# EAGLE design USB23DO (EAGLE 9.6.2)
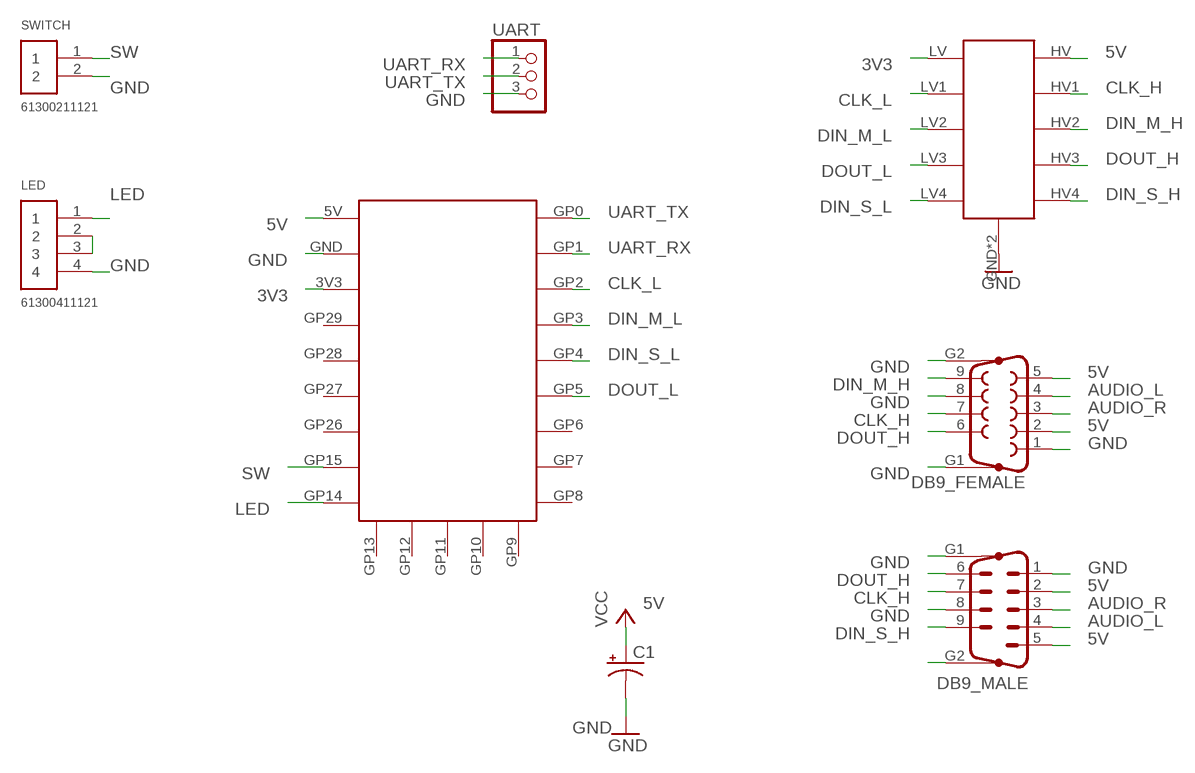
[diagram p0: schematic, sheet 1]

## Parts
C1  CPOL-USB45181A  [B45181A]
DB9_FEMALE  F09HP  [F09HP]
DB9_MALE  M09HP  [M09HP]
LED  61300411121  [61300411121]
LVL_SHIFTER  4WAYS_LEVEL_SHIFTER  [4WAYS_LEVEL_SHIFTER]
RP2040-ZERO  WAVESHARE_RP_2040_ZERO  [WAVESHARE_RP_2040_ZERO]
SWITCH  61300211121  [61300211121]
UART  PINHD-1X3CB  [1X03-CLEANBIG]

## Nets
3V3: LVL_SHIFTER.LV RP2040-ZERO.3V3
5V: C1.+ DB9_FEMALE.2 DB9_FEMALE.5 DB9_MALE.2 DB9_MALE.5 LVL_SHIFTER.HV RP2040-ZERO.5V ; supply symbol labelled VCC
AUDIO_L: DB9_FEMALE.4 DB9_MALE.4
AUDIO_R: DB9_FEMALE.3 DB9_MALE.3
CLK_H: DB9_FEMALE.7 DB9_MALE.7 LVL_SHIFTER.HV1
CLK_L: LVL_SHIFTER.LV1 RP2040-ZERO.GP2
DIN_M_H: DB9_FEMALE.9 LVL_SHIFTER.HV2
DIN_M_L: LVL_SHIFTER.LV2 RP2040-ZERO.GP3
DIN_S_H: DB9_MALE.9 LVL_SHIFTER.HV4
DIN_S_L: LVL_SHIFTER.LV4 RP2040-ZERO.GP4
DOUT_H: DB9_FEMALE.6 DB9_MALE.6 LVL_SHIFTER.HV3
DOUT_L: LVL_SHIFTER.LV3 RP2040-ZERO.GP5
GND: C1.- DB9_FEMALE.1 DB9_FEMALE.8 DB9_FEMALE.G1 DB9_FEMALE.G2 DB9_MALE.1 DB9_MALE.8 DB9_MALE.G1 LED.4 LVL_SHIFTER.GND LVL_SHIFTER.GND_1(GND) RP2040-ZERO.GND SWITCH.2 UART.3
LED: LED.1 RP2040-ZERO.GP14
N$1: LED.2 LED.3
N$2: DB9_MALE.G2
SW: RP2040-ZERO.GP15 SWITCH.1
UART_RX: RP2040-ZERO.GP1 UART.1
UART_TX: RP2040-ZERO.GP0 UART.2
Unconnected: RP2040-ZERO.GP6 RP2040-ZERO.GP7 RP2040-ZERO.GP8 RP2040-ZERO.GP9 RP2040-ZERO.GP10 RP2040-ZERO.GP11 RP2040-ZERO.GP12 RP2040-ZERO.GP13 RP2040-ZERO.GP26 RP2040-ZERO.GP27 RP2040-ZERO.GP28 RP2040-ZERO.GP29

## Library data of the parts
C1 = adafruit:CPOL-US: POLARIZED CAPACITOR, American symbol
DB9_FEMALE = con-subd:F09HP: SUB-D; OC_FARNELL: unknown; OC_NEWARK: unknown
DB9_MALE = con-subd:M09HP: SUB-D; OC_FARNELL: unknown; OC_NEWARK: unknown
LED = Headers:61300411121: CONN HEADER VERT 4POS 2.54MM Manufacturer's datasheet <https://katalog.we-online.de/em/datasheet/6130xx11121.pdf>; CREATED_BY: PCBLayout.com; DIGI_KEY_PART_NUMBER: 732-5317-ND; MANUFACTURER: Wurth Electronics Inc.; MPN: 61300411121
LVL_SHIFTER = FunModules:4WAYS_LEVEL_SHIFTER
RP2040-ZERO = FunModules:WAVESHARE_RP_2040_ZERO
SWITCH = Headers:61300211121: CONN HEADER VERT 2POS 2.54MM Manufacturer's datasheet <https://katalog.we-online.de/em/datasheet/6130xx11121.pdf>; CREATED_BY: PCBLayout.com; DIGI_KEY_PART_NUMBER: 732-5315-ND; MANUFACTURER: Wurth Electronics Inc.; MPN: 61300211121
UART = adafruit:PINHD-1X3: PIN HEADER

## Board
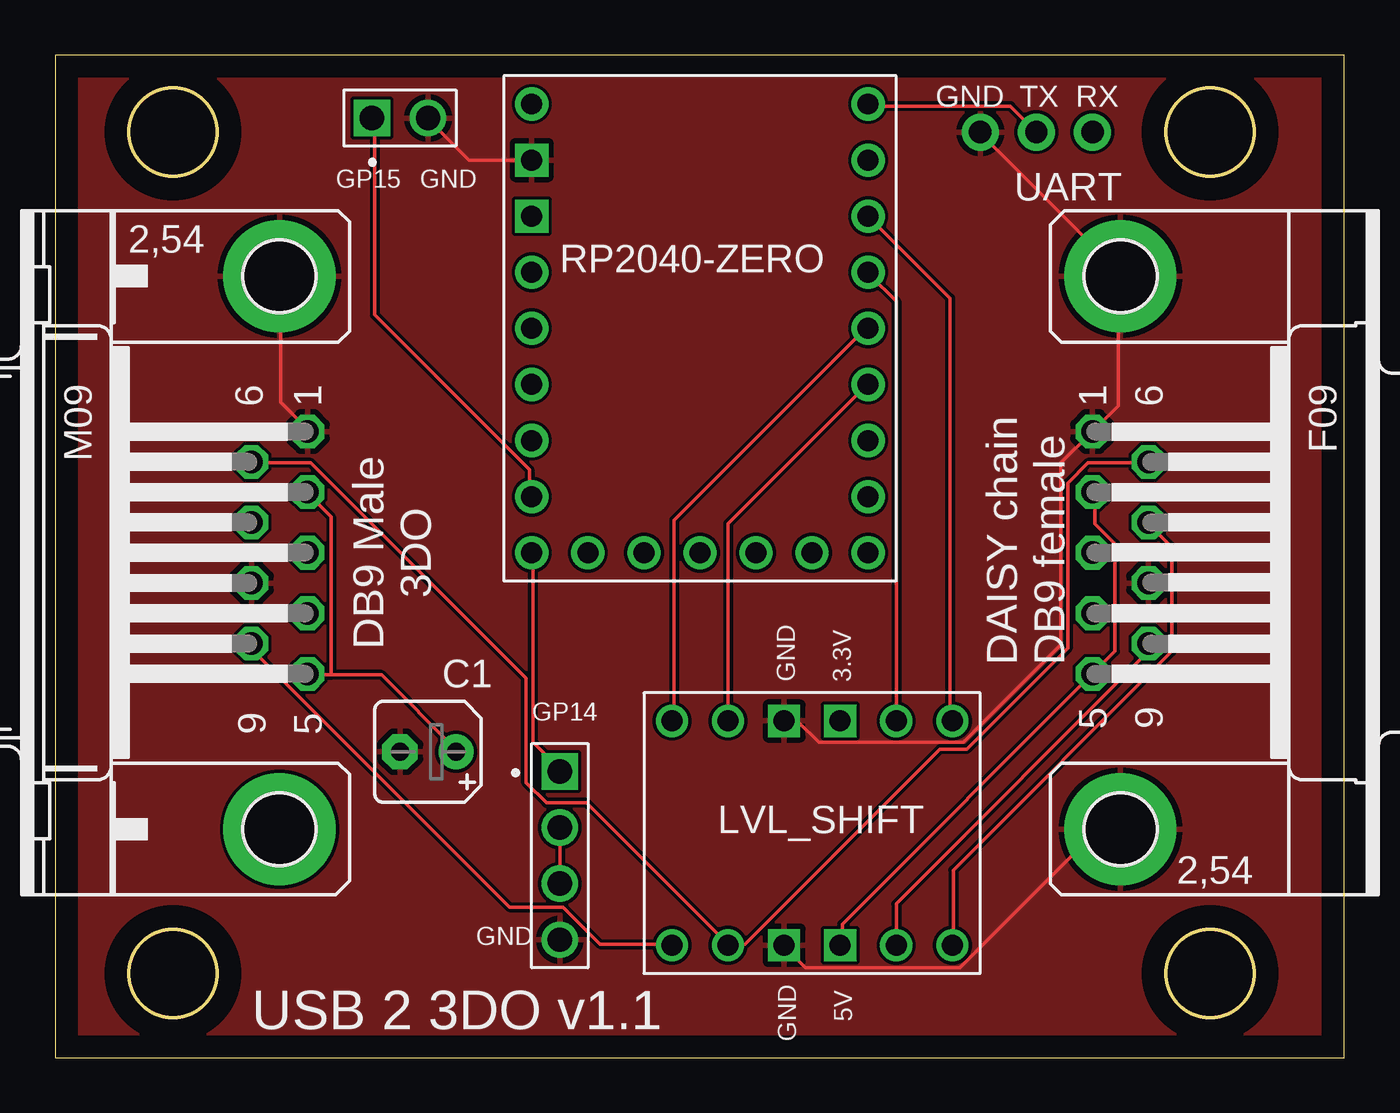
[diagram p1: board, top side]
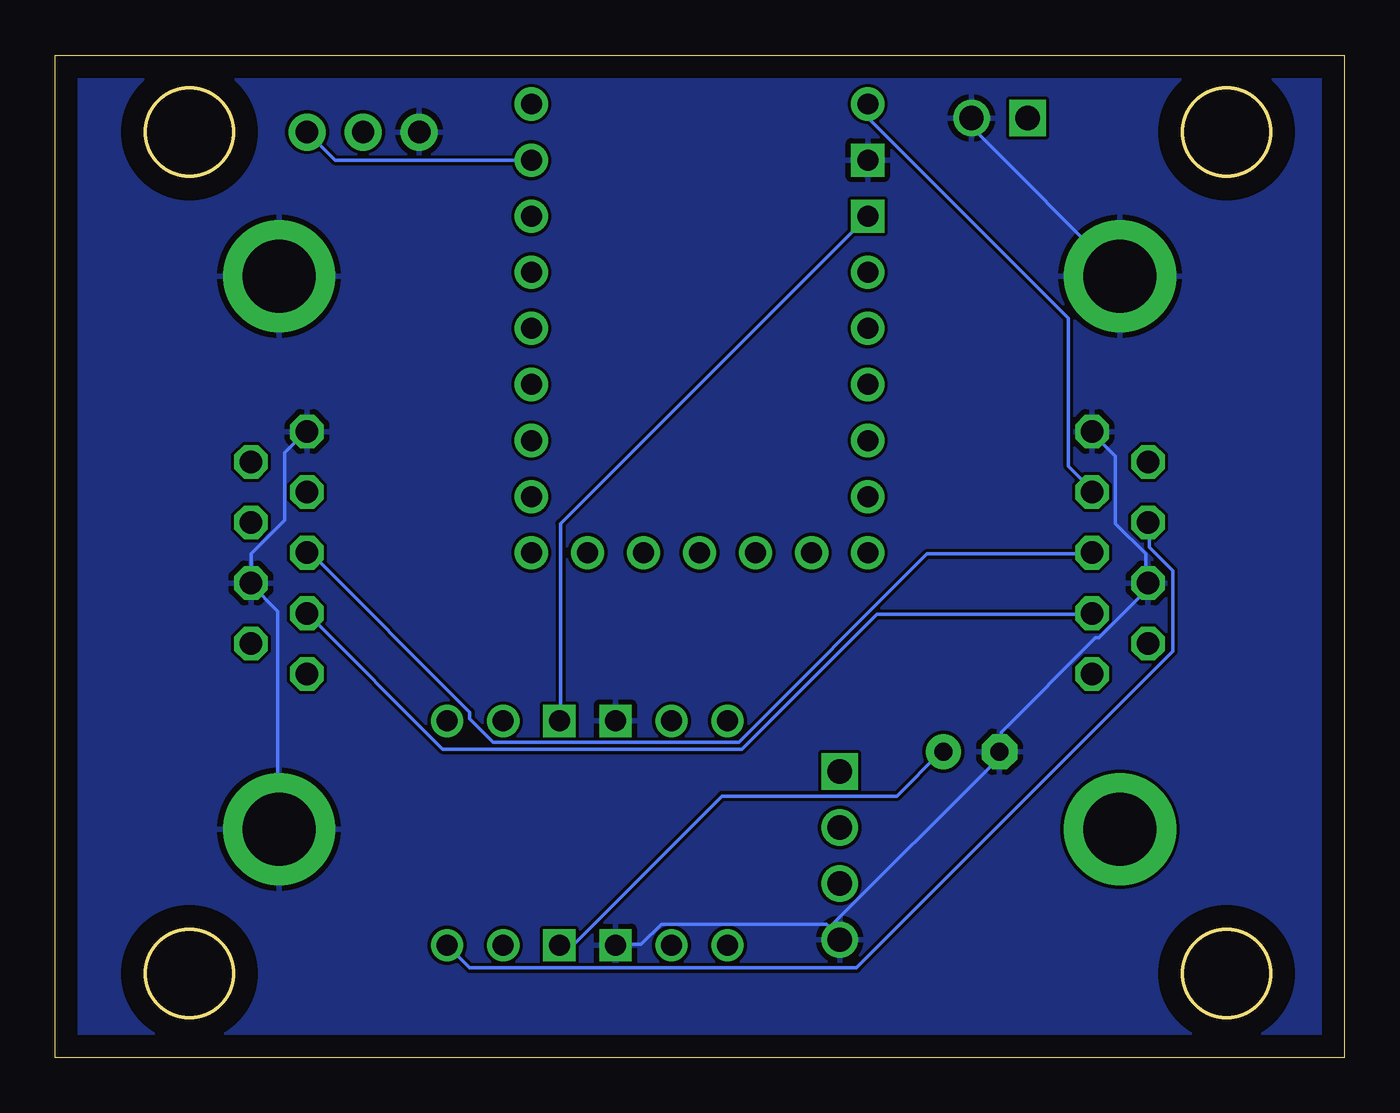
[diagram p2: board, bottom side, seen from below]

Size 58.4 x 45.39 mm. Coordinates in mm from the lower left corner, seen from the top.
Outline: 0,0 58.4,0 58.4,45.39 0,45.39 0,0
Outline: circle at 5.33,41.91 radius 2
Outline: circle at 5.33,3.81 radius 2
Outline: circle at 52.32,3.81 radius 2
Outline: circle at 52.32,41.91 radius 2
Copper layers (1*16): Top 0.035mm / dielectric 1.5mm / Bottom 0.035mm
Design rules "default": minimum track width 6mil, minimum drill 0.35mm, track to track 6mil, track to pad 6mil, pad to pad 6mil, via to via 6mil, smd to smd 6mil, copper to edge 40mil, drill to drill 6mil, minimum pad ring 10mil, minimum via ring 8mil, stop-mask expansion 4mil, vias tented up to drill 0mil, thermal gap 10mil

### Footprints (pad centres in the part's own frame; a part is rotated, then mirrored left to right if it is on the bottom)
B45181A = drill 0.813 pad 1.6: + -1.27,0 | drill 0.813 pad 1.6 octagon: - 1.27,0
F09HP = drill 1.016 octagon: 1 -5.486,-1.27; 2 -2.743,-1.27; 3 0,-1.27; 4 2.743,-1.27; 5 5.486,-1.27; 6 -4.115,1.27; 7 -1.372,1.27; 8 1.372,1.27; 9 4.115,1.27 | drill 3.302 pad 5.08: G1 -12.522,0; G2 12.522,0
M09HP = drill 1.016 octagon: 1 -5.486,1.27; 2 -2.743,1.27; 3 0,1.27; 4 2.743,1.27; 5 5.486,1.27; 6 -4.115,-1.27; 7 -1.372,-1.27; 8 1.372,-1.27; 9 4.115,-1.27 | drill 3.302 pad 5.08: G1 -12.522,0; G2 12.522,0
61300411121 = drill 1.1 square: 1 -3.81,0 | drill 1.1: 2 -1.27,0; 3 1.27,0; 4 3.81,0
4WAYS_LEVEL_SHIFTER = drill 0.95 square: GND -5.08,-1.27; GND_1 5.08,-1.27; HV 5.08,1.27; LV -5.08,1.27 | drill 0.95: HV1 5.08,6.35; HV2 5.08,3.81; HV3 5.08,-3.81; HV4 5.08,-6.35; LV1 -5.08,6.35; LV2 -5.08,3.81; LV3 -5.08,-3.81; LV4 -5.08,-6.35
WAVESHARE_RP_2040_ZERO = drill 0.95 pad 1.5 square: 3V3 -19.05,2.54; GND -19.05,5.08 | drill 0.95 pad 1.5: 5V -19.05,7.62; GP0 -3.81,7.62; GP1 -3.81,5.08; GP2 -3.81,2.54; GP3 -3.81,0; GP4 -3.81,-2.54; GP5 -3.81,-5.08; GP6 -3.81,-7.62; GP7 -3.81,-10.16; GP8 -3.81,-12.7; GP9 -6.35,-12.7; GP10 -8.89,-12.7; GP11 -11.43,-12.7; GP12 -13.97,-12.7; GP13 -16.51,-12.7; GP14 -19.05,-12.7; GP15 -19.05,-10.16; GP26 -19.05,-7.62; GP27 -19.05,-5.08; GP28 -19.05,-2.54; GP29 -19.05,0
61300211121 = drill 1.1 square: 1 -1.27,0 | drill 1.1: 2 1.27,0
1X03-CLEANBIG = drill 1.016 pad 1.676: 1 -2.54,0; 2 0,0; 3 2.54,0

### Placement (x,y rotation side)
C1  16.89,13.84 180 top
DB9_FEMALE  48.26,22.86 270 top
DB9_MALE  10.16,22.86 270 top
LED  22.86,9.14 270 top
LVL_SHIFTER  34.29,10.16 270 top
RP2040-ZERO  40.64,35.56 0 top
SWITCH  15.62,42.55 0 top
UART  44.45,41.91 180 top

### Tracks (layer width: path | path; a pad name or v marks a point on that pad's centre or on a via)
3V3
  Bottom 0.152: RP2040-ZERO.3V3 35.51,24.18 35.51,15.34 LVL_SHIFTER.LV
5V
  Top 0.152: LVL_SHIFTER.HV 35.66,5.13 35.66,6.05 DB9_FEMALE.5 48.01,18.39 48.01,23.27 47.09,24.18 47.09,25.55 DB9_FEMALE.2 | 12.5,17.32 14.78,17.32 18.14,13.97 C1.+ | 12.5,17.32 11.43,17.32 DB9_MALE.5 | 12.5,17.32 12.5,24.49 11.43,25.55 DB9_MALE.2
  Bottom 0.152: RP2040-ZERO.5V 21.49,43.08 21.49,42.47 12.5,33.48 12.5,26.77 11.43,25.7 DB9_MALE.2 | LVL_SHIFTER.HV 35.51,5.13 34.9,5.13 28.19,11.84 20.27,11.84 18.29,13.82 C1.+
AUDIO_L
  Bottom 0.152: DB9_FEMALE.4 40.84,13.97 27.28,13.97 21.18,20.07 11.43,20.07 DB9_MALE.4
AUDIO_R
  Bottom 0.152: DB9_MALE.3 11.43,22.81 18.9,22.81 27.43,14.28 38.56,14.28 39.62,15.34 39.62,15.65 46.94,22.96 DB9_FEMALE.3
CLK_H
  Top 0.152: LVL_SHIFTER.HV1 40.69,5.13 40.69,8.48 50.6,18.39 50.6,23.11 49.53,24.18 DB9_FEMALE.7
  Bottom 0.152: LVL_SHIFTER.HV1 39.62,4.06 22.1,4.06 7.77,18.39 7.77,22.05 8.84,23.11 8.84,24.18 DB9_MALE.7
CLK_L
  Top 0.152: RP2040-ZERO.GP2 40.54,34.39 40.54,15.34 LVL_SHIFTER.LV1
DIN_M_H
  Top 0.152: LVL_SHIFTER.HV2 38.1,6.96 49.53,18.39 DB9_FEMALE.9
DIN_M_L
  Top 0.152: LVL_SHIFTER.LV2 38.1,34.24 36.88,35.46 RP2040-ZERO.GP3
DIN_S_H
  Top 0.152: LVL_SHIFTER.HV4 27.89,5.13 24.69,5.13 23.01,6.81 20.57,6.81 8.99,18.39 8.99,18.69 DB9_MALE.9
DIN_S_L
  Top 0.152: LVL_SHIFTER.LV4 28.04,15.34 28.04,24.33 36.73,33.02 RP2040-ZERO.GP4
DOUT_H
  Top 0.152: 30.48,5.13 31.24,5.13 40.08,13.97 41.3,13.97 45.87,18.54 45.87,26.01 46.79,26.92 49.53,26.92 DB9_FEMALE.6 | 30.48,5.13 24.08,11.53 22.25,11.53 21.34,12.45 21.34,17.17 11.58,26.92 8.99,26.92 DB9_MALE.6 | 30.48,5.13 LVL_SHIFTER.HV3
DOUT_L
  Top 0.152: LVL_SHIFTER.LV3 30.48,24.18 36.73,30.43 RP2040-ZERO.GP5
GND
  Top 0.152: UART.3 41.91,41.86 48.31,35.46 DB9_FEMALE.G1 48.16,35.31 48.16,29.52 DB9_FEMALE.1 45.57,26.92 45.57,18.69 41.15,14.28 34.59,14.28 33.68,15.19 33.07,15.19 LVL_SHIFTER.GND | RP2040-ZERO.GND 18.75,40.64 16.92,42.47 SWITCH.2 | DB9_MALE.G1 10.21,35.31 10.21,29.67 11.43,28.45 DB9_MALE.1 | DB9_FEMALE.G2 48.16,10.31 47.24,10.31 41,4.06 33.98,4.06 33.07,4.98 LVL_SHIFTER.GND_1
  Bottom 0.152: DB9_FEMALE.1 47.09,28.3 48.01,27.38 48.01,24.33 49.53,22.81 DB9_FEMALE.8 49.53,21.44 48.31,20.22 48.31,10.47 DB9_FEMALE.G2 | SWITCH.2 16.76,42.47 16.76,42.01 10.21,35.46 DB9_MALE.G1 | 23.32,5.89 22.86,5.44 LED.4 23.32,5.89 | 23.32,5.89 23.47,6.05 30.94,6.05 31.85,5.13 32.92,5.13 LVL_SHIFTER.GND_1 | DB9_MALE.1 11.43,28.3 10.36,27.23 10.36,24.18 8.99,22.81 8.99,21.59 DB9_MALE.8 8.99,21.44 8.99,21.13 11.12,19 11.28,19 15.54,14.73 15.54,13.97 C1.- 15.7,13.82 15.7,13.51 23.32,5.89
  pour Bottom: 0.25,45.21 58.17,45.21 58.17,44.96 58.17,0.25 57.91,0.25 0.25,0.25
  pour Top: 0.25,45.21 0.25,0.25 58.17,0.25 58.17,45.21
LED
  Top 0.152: RP2040-ZERO.GP14 21.64,22.81 21.64,14.28 22.86,13.06 LED.1
N$1
  Top 0.152: LED.2 LED.3
SW
  Top 0.152: RP2040-ZERO.GP15 21.49,25.4 21.49,26.62 14.48,33.63 14.48,42.47 SWITCH.1
UART_RX
  Bottom 0.152: RP2040-ZERO.GP1 45.72,40.64 UART.1
UART_TX
  Top 0.152: UART.2 43.28,43.08 36.88,43.08 RP2040-ZERO.GP0

### Text on the board
tNames: GND | TX | RX | GP15 | GND | DB9 Male / 3DO | GND | 3.3V | DAISY chain / DB9 female | GP14 | GND | GND | 5V | USB 2 3DO v1.1